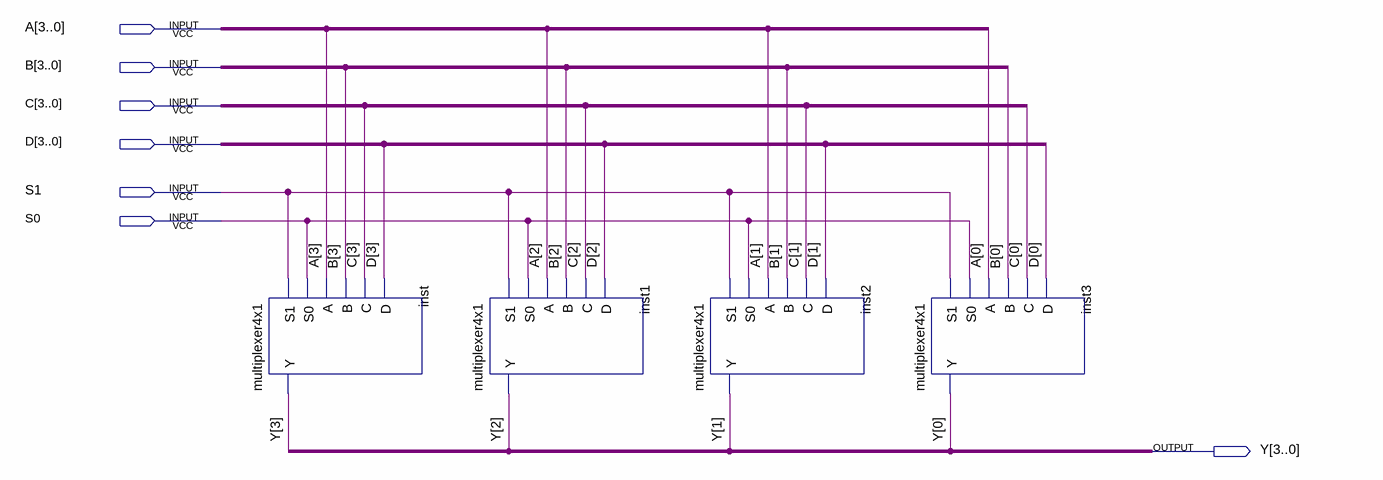
[diagram p0: schematic sheet]
// Quartus schematic multiplexer_16x4_4x1.bdf as structural Verilog: 4 symbols, 7 pins
module multiplexer_16x4_4x1 (
  input  [3:0] A,
  input  [3:0] B,
  input  [3:0] C,
  input  [3:0] D,
  input  S1,
  input  S0,
  output [3:0] Y
);

  multiplexer4x1 inst (.S1(S1), .S0(S0), .A(A[3]), .B(B[3]), .C(C[3]), .D(D[3]), .Y(Y[3]));
  multiplexer4x1 inst1 (.S1(S1), .S0(S0), .A(A[2]), .B(B[2]), .C(C[2]), .D(D[2]), .Y(Y[2]));
  multiplexer4x1 inst2 (.S1(S1), .S0(S0), .A(A[1]), .B(B[1]), .C(C[1]), .D(D[1]), .Y(Y[1]));
  multiplexer4x1 inst3 (.S1(S1), .S0(S0), .A(A[0]), .B(B[0]), .C(C[0]), .D(D[0]), .Y(Y[0]));
endmodule
